# Altium schematic sheet Master.SchDoc
size 431 x 279 mm; SheetNumber: 1; SheetTotal: 2; ENG_APP_DATE: --/--/--; DSN_APP_DATE: --/--/--; CHK_APP_DATE: --/--/--
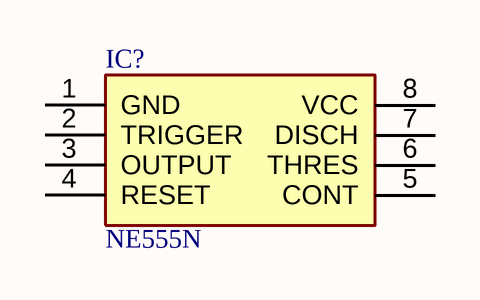
[diagram p0: Master.SchDoc]

## Parts
IC?  NE555N  [DIP762W56P254L959H533Q8N]

## Nets

Not connected (* = marked no-connect by the designer): IC? 1(GND) 2(TRIGGER) 3(OUTPUT) 4(RESET) 5(CONT) 6(THRES) 7(DISCH) 8(VCC)

## Notes on the sheet
- DWG. NO.
- REV.
- SHT.
- THIS DOCUMENT AND THE DATA DISCLOSED HEREIN OR HEREWITH IS THE PROPERTY OF ALTIUM LIMITED AND MAY BE FREELY DISTRIBUTED IN WHOLE. NO RIGHTS ARE RESERVED OR EXPRESS OR IMPLIED WARANTEE GIVEN.
- REVISION
- DESCRIPTION
- DATE
- APPROVED
- ENG:
- APPROVALS
- PROJECT
- DSN:
- CHK:
- REFERENCE DOCUMENTS
- PROJECT REVISION:
- TITLE
- DOCUMENT REVISION:
- DESIGN ITEM:
- BOM:
- FAB DWG:
- PCB DWG:
- ASSY DWG:
- SCALE:
- SIZE
- B
- CAGE CODE
- FILE NAME
- DWG NO.
- SHEET
- OF
- REV

## Library data of the parts
IC? = NE555N: Integrated Circuit; Manufacturer_Name: HGSEMI; Datasheet Link: https://datasheet.lcsc.com/szlcsc/1906111919_HGSEMI-NE555N_C398063.pdf; Height: 5.33mm; Manufacturer_Part_Number: NE555N